# Altium schematic sheet SW_Assignments.SCHDOC
size A; Organization: Altium Limited; Address1: L3, 12a Rodborough Rd; Address2: Frenchs Forest; Address3: NSW; Address4: Australia 2086; DocumentNumber: 6; SheetNumber: 6; SheetTotal: 8
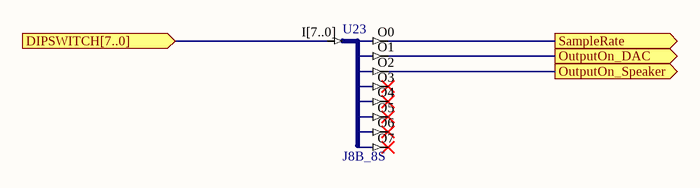
[diagram p0: SW_Assignments.SCHDOC]

## Parts
U23  J8B_8S

## Ports
DIPSWITCH[7..0] (in), OutputOn_DAC (out), OutputOn_Speaker (out), SampleRate (out)

## Nets
DIPSWITCH[7..0]: U23.I[7..0] ; port DIPSWITCH[7..0]
OutputOn_DAC: U23.O1 ; port OutputOn_DAC
OutputOn_Speaker: U23.O2 ; port OutputOn_Speaker
SampleRate: U23.O0 ; port SampleRate

Not connected (* = marked no-connect by the designer): U23 O3* O4* O5* O6* O7*

## Notes on the sheet
- Title
- Size:
- Date:
- A
- Number:
- Time:
- Revision:
- Sheet
- of
- File:

## Library data of the parts
U23 = J8B_8S: 8-Bit input bus to 8 single pin outputs; ArchiveName: GENERIC; Published: 18-Nov-2003; Publisher: Altium Limited; Core Revision: 1.00.00